# Altium schematic sheet VectorModulator.SchDoc
size OrCAD E
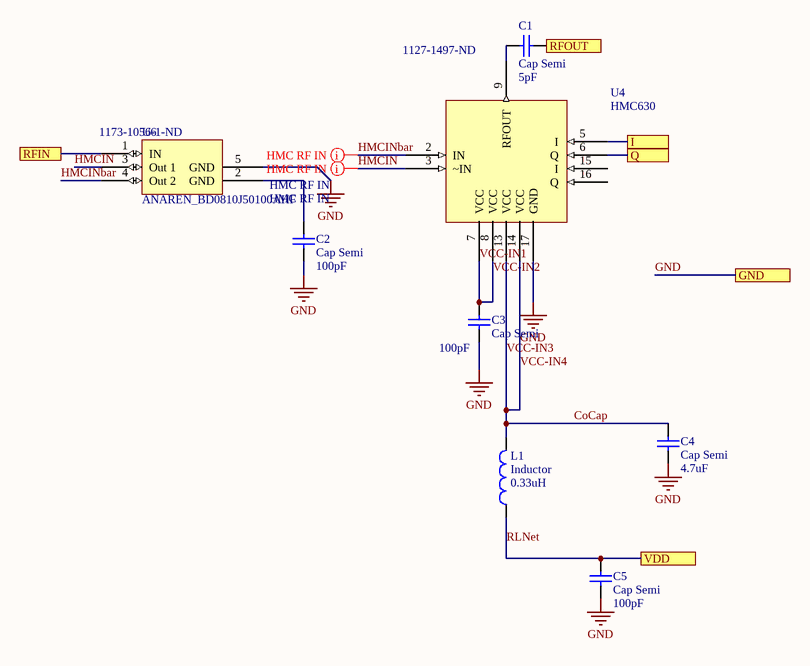
[diagram p0: VectorModulator.SchDoc]

## Parts
C1  Cap Semi  value 5pF  [0402]
C2  Cap Semi  value 100pF  [0402]
C3  Cap Semi  value 100pF  [0402]
C4  Cap Semi  value 4.7uF  [0402]
C5  Cap Semi  value 100pF  [0402]
L1  Inductor  value 0.33uH  [0402-A]
U4  HMC630  Supplier Part Number 1: 1127-1497-ND  [*QFN50P300X300X100-17N]
U6  ANAREN_BD0810J50100AHF  Supplier Part Number 1: 1173-1056-1-ND  [*ANAREN_PD0409J7575S2HF]

## Ports
GND, I, Q, RFIN, RFOUT, VDD

## Nets
GND: C2.1 C3.1 C4.1 C5.1 U4.17(GND) U6.5(GND) ; port GND
CoCap: C4.2 L1.2 U4.13(VCC) U4.14(VCC)  [also labelled VCC-IN3, VCC-IN4]
HMCIN: U4.3(~IN) U6.3(Out_1)
HMCINbar: U4.2(IN) U6.4(Out_2)
I: U4.5(I) ; port I
Q: U4.6(Q) ; port Q
RFIN: U6.1(IN) ; port RFIN
RFOUT: C1.2 ; port RFOUT
RLNet: C5.2 L1.1 ; port VDD
VCC-IN1: C3.2 U4.7(VCC) U4.8(VCC)  [also labelled VCC-IN2]
NetC1_1: C1.1 U4.9(RFOUT)
NetC2_2: C2.2 U6.2(GND)

Not connected (* = marked no-connect by the designer): U4 15(I) 16(Q)

## Layout directives
net class HMC RF IN; rule Clearance GAP=5mil; rule Width MAXLIMIT=11.833mil MINLIMIT=11.833mil PREFEREDWIDTH=11.833mil: HMCIN, HMCINbar

## Library data of the parts
C1-C5 = Cap Semi: Capacitor (Semiconductor SIM Model); Published: 8-Jun-2000; LatestRevisionDate: 29-May-2009; LatestRevisionNote: IPC-7351 Footprint Added.; PackageReference: C1206; Publisher: Altium Limited; PackageDescription: Chip Capacitor
L1 = Inductor: Code_IEC: 1005; Published: 8-Jun-2000; LatestRevisionDate: 29-May-2009; LatestRevisionNote: IPC-7351 Footprint Added.; PackageReference: 0402-A; Publisher: Altium Limited; PackageDescription: Chip Inductor; Code_JEITA: 0402
U4 = HMC630: Supplier 1: Digi-Key
U6 = ANAREN_BD0810J50100AHF: Supplier 1: Digi-Key